# Altium schematic sheet 1S_BATTERY_CHARGER_SCH.SchDoc
size 300 x 200 mm
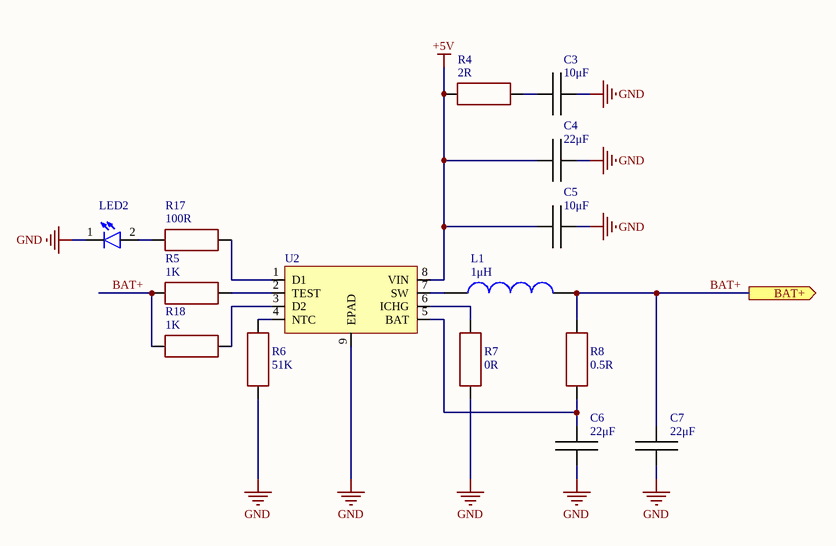
[diagram p0: 1S_BATTERY_CHARGER_SCH.SchDoc]

## Parts
C3  value 10μF  [CAP: 0603]  (hidden comment: Cap_0603)
C4  value 22μF  [CAP: 0603]  (hidden comment: Cap_0603)
C5  value 10μF  [CAP: 0603]  (hidden comment: Cap_0603)
C6  value 22μF  [CAP: 0603]  (hidden comment: Cap_0603)
C7  value 22μF  [CAP: 0603]  (hidden comment: Cap_0603)
L1  value 1μH  [CDRH74]  (hidden comment: CDRH74)
LED2  LED_0603  [LED_0603]  (value not drawn)
R4  value 2R  [RES: 0603]  (hidden comment: Resistor_0603)
R5  value 1K  [RES: 0603]  (hidden comment: Resistor_0603)
R6  value 51K  [RES: 0603]  (hidden comment: Resistor_0603)
R7  value 0R  [RES: 0603]  (hidden comment: Resistor_0603)
R8  value 0.5R  [RES: 0603]  (hidden comment: Resistor_0603)
R17  value 100R  [RES: 0603]  (hidden comment: Resistor_0603)
R18  value 1K  [RES: 0603]  (hidden comment: Resistor_0603)
U2  IP2312  [ESOP-8]  (value not drawn)

## Ports
BAT+ (out)

## Nets
+5V: C4.2 C5.2 R4.1 U2.8(VIN)
GND: C3.1 C4.1 C5.1 C6.2 C7.2 LED2.1 R6.1 R7.2 U2.9(EPAD)
BAT+: C7.1 L1.1 R5.1 R8.2 R18.1 ; port BAT+
NetC3_2: C3.2 R4.2
NetC6_1: C6.1 R8.1 U2.5(BAT)
NetL1_2: L1.2 U2.7(SW)
NetLED2_2: LED2.2 R17.1
NetR5_2: R5.2 U2.2(TEST)
NetR6_2: R6.2 U2.4(NTC)
NetR7_1: R7.1 U2.6(ICHG)
NetR17_2: R17.2 U2.1(D1)
NetR18_2: R18.2 U2.3(D2)

## Library data of the parts
C3-C7 = Cap_0603: TypeDielectric: X7R(X5R); Voltage: ??V; Package/Case: 0603; Temperature: -55...+125°C(-55...+85°C); Product Category: Capacitors
L1 = CDRH74: SMD Power Inductor; Manufacturer: SUMIDA; Datasheet: https://radiokomponent.com.ua/pdf/trans/CDRH74.pdf; HelpURL: https://aliexpress.ru/item/1005004321960425.html?sku_id=12000028751500104&spm=a2g2w.productlist.search_results.7.529b6cc4mPaVds; Product Category: Inductors
R4-R8 R17 R18 = Resistor_0603: Tolerance: ±5%; Package/Case: 0603; Temperature: -55...+125°C; Product Category: Resistors
U2 = IP2312: 1s charge module; Manufacturer: INJOINIC; Datasheet: https://datasheet.lcsc.com/lcsc/2304140030_INJOINIC-IP2312-4V35_C605433.pdf; HelpURL: https://aliexpress.ru/item/1005006314271382.html?spm=a2g2w.favourites.mywishlist.41.12044aa670bhdZ&sku_id=12000036725210626; Package/Case: ESOP-8; Product Category: Charge modules; Value: IP2312
LED2 = LED_0603: Product Category: LED; Value: LED_0603